# EasyEDA Pro project CAN2RPM.epro

# Schematic untitled
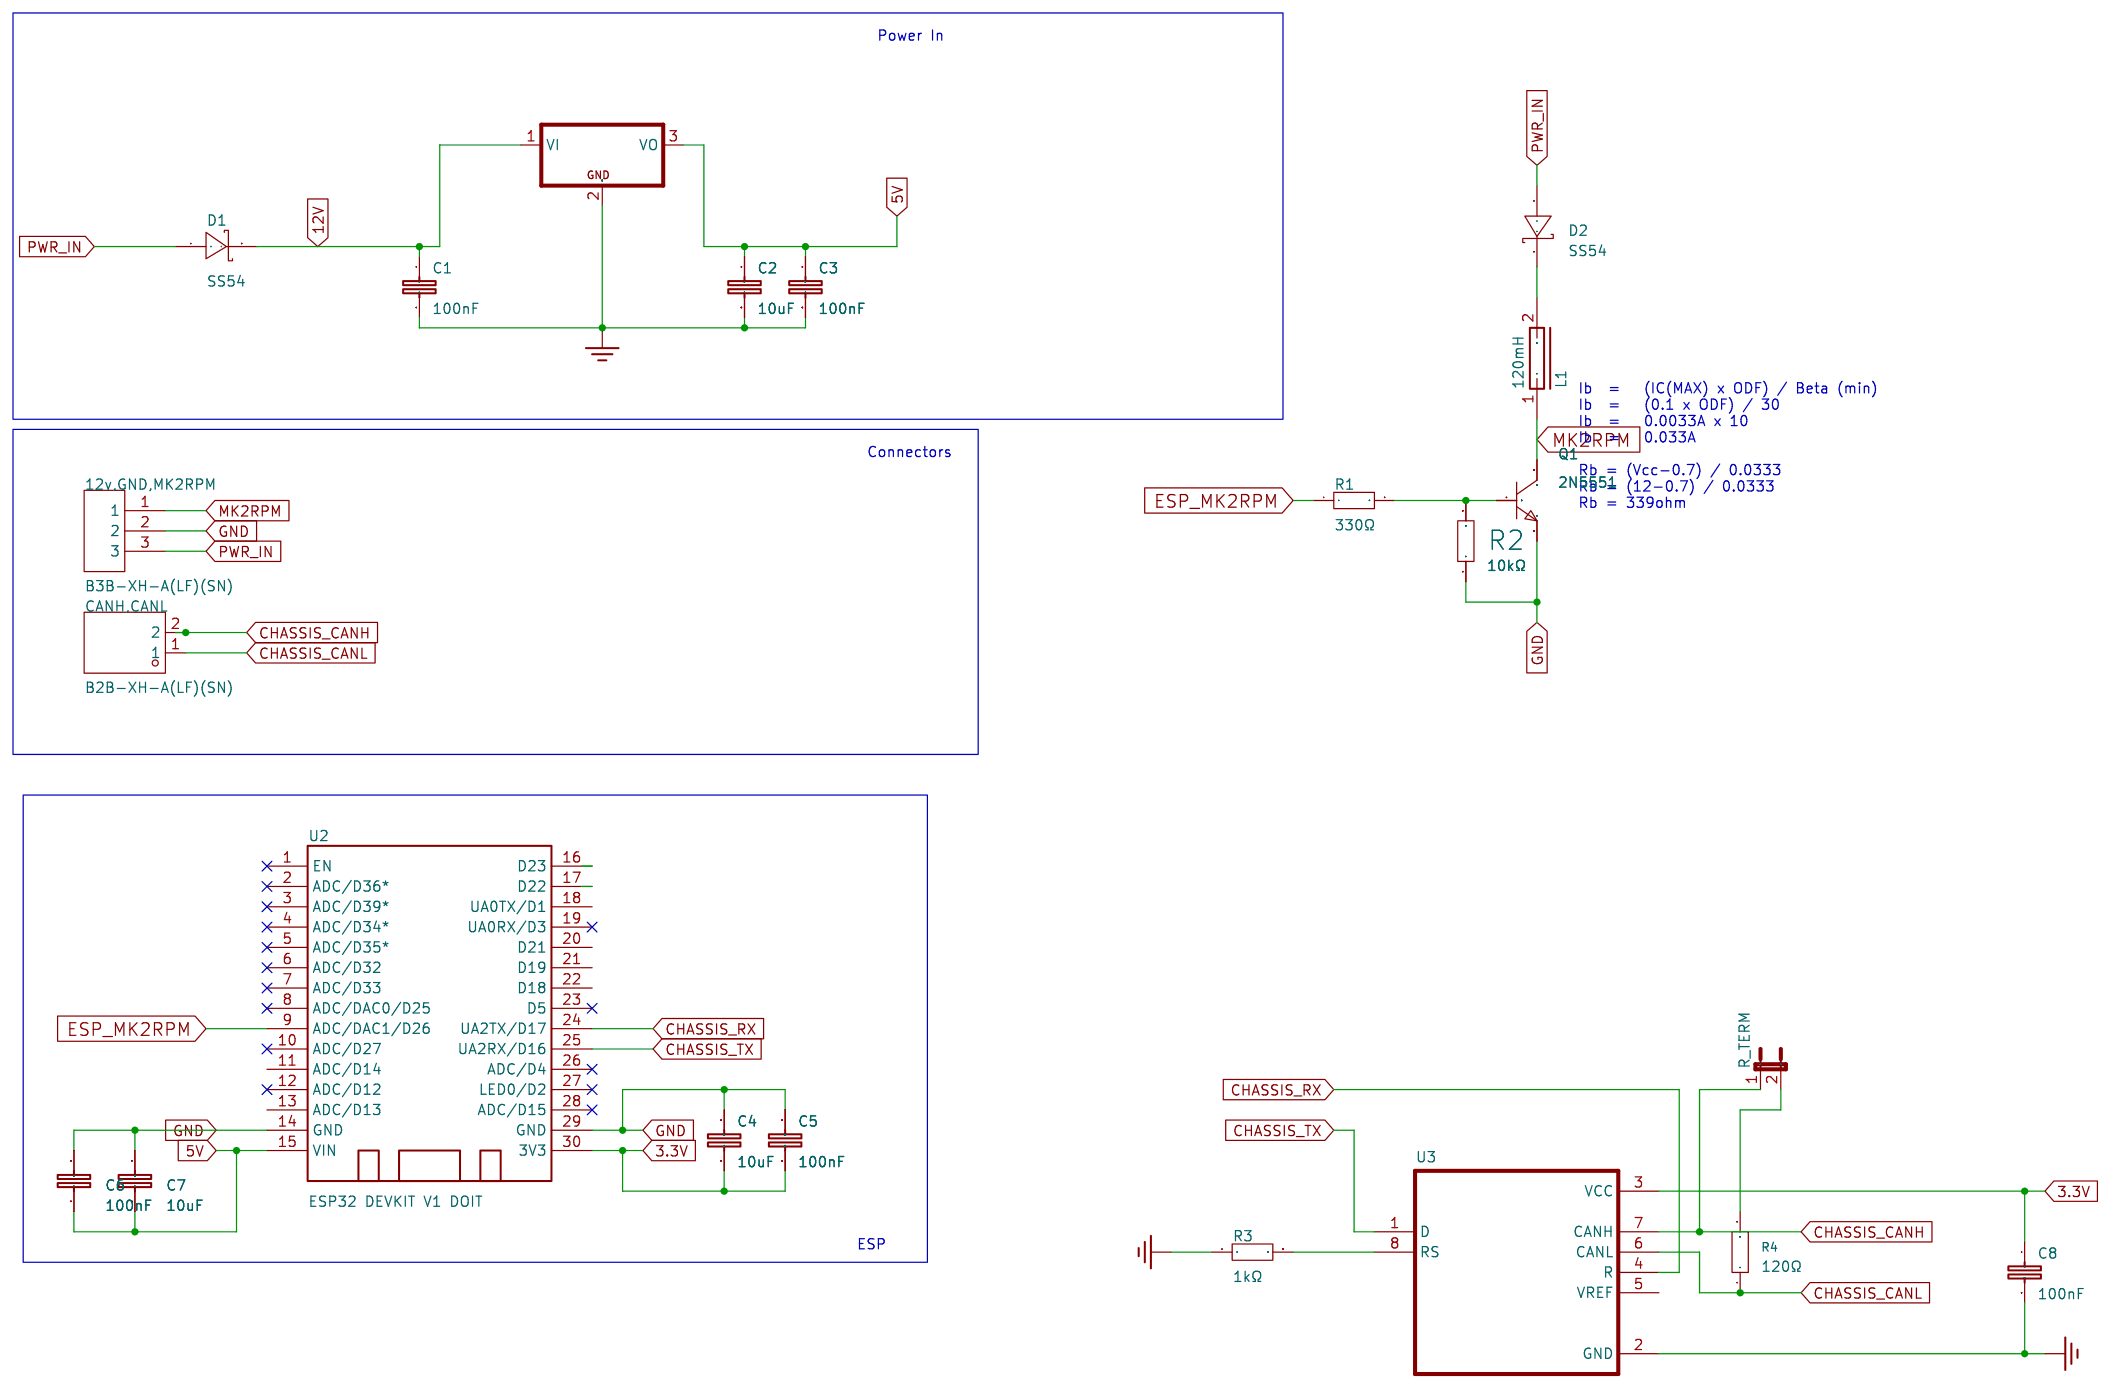
[diagram p0: schematic sheet]

## Parts
12v,GND,MK2RPM  B3B-XH-A(LF)(SN)  [CONN-TH_3P-P2.50_A2501WV2-3P]
C1  100nF  [C0805]
C2  10uF  [C0805]
C3  100nF  [C0805]
C4  10uF  [C0805]
C5  100nF  [C0603]
C6  100nF  [C0603]
C7  10uF  [C0805]
C8  100nF  [C0805]
CANH,CANL  B2B-XH-A(LF)(SN)  [CONN-TH_B2B-XH-A-LF-SN]
D1  SS54  [SMA_L4.4-W2.8-LS5.4-R-RD]
D2  SS54  [SMA_L4.4-W2.8-LS5.4-R-RD]
IC1  L7805ABD2T-TR  [TO-263-2_L10.0-W9.2-P5.08-LS15.3-TL-CW]
L1  120mH  [IND-SMD_L12.5-W12.5]
Q1  2N5551  [SOT-23-3_L2.9-W1.4-P1.90-LS2.5-BR]
R1  330Ω  [R0603]
R2  10kΩ  [R0603]
R3  1kΩ  [R0603]
R4  120Ω  [R0603]
R_TERM  PZ254V-11-02P  [HDR-TH_2P-P2.54-V-M]
U2  ESP32 DEVKIT V1 DOIT  [DOIT-ESP32-DEVKIT-V1]
U3  SN65HVD230DR  [SOIC-8_L4.9-W3.9-P1.27-LS6.0-BL]

## Library data of the parts
12v,GND,MK2RPM = B3B-XH-A(LF)(SN): Pins Structure:1x3P Pitch:2.5mm Mounting Style:Direct Insert Reference Series:XH Number of Pins:3P Number of Rows:1 Number of PINs Per Row:3 Row Spacing:- Current Rating (Max):3A Contact Material:Brass Contact Plating:Tin Operating Temperature Range:-25℃~; LCSC Part Name: 1x3P 间距:2.5mm 直插 系列:XH; Supplier Part: C144394; Manufacturer: JST; Supplier Footprint: 插件,P=2.5mm; JLCPCB Part Class: Extended Part; Datasheet: https://atta.szlcsc.com/upload/public/pdf/source/20180928/C265283_F9DFEEBDB2CF642B6BDFAB4B77BD2680.pdf; Supplier: LCSC; Pins Structure: 1x3P; Pitch: 2.5mm; Mounting Style: Direct Insert; Reference Series: XH; Number of Pins: 3P; Number of Rows: 1; Number of PINs Per Row: 3; Current Rating (Max): 3A; Contact Material: Brass; Contact Plating: Tin; Operating Temperature Range: -25℃~+85℃; Rated Voltage (Max): 250V; Plastic Material: PA66; Flame Retardant Rating: UL94V-0; Supplementary Features: K-leg punch; Colour: White; Z-Height of the Board: 7mm; X-Length of Bottom Edge on Board (Spacing Line): 9.9mm; Y-Width of Bottom Edge on Board: 5.75mm
C1 C3 C8 = CT41G-0805-2X1-50V-0.1μF-K(N): Capacitance:100nF Tolerance:±10% Tolerance:±10% Voltage Rating:50V Temperature Coefficient:-; LCSC Part Name: 100nF ±10% 50V; Supplier Part: C126469; Manufacturer: TORCH(火炬); Supplier Footprint: 0805; JLCPCB Part Class: Extended Part; Datasheet: https://atta.szlcsc.com/upload/public/pdf/source/20171225/C150708_15141883600121203188.pdf; Supplier: LCSC; Tolerance: ±10%; Voltage Rating: 50V
C2 C4 C7 = CL21A106KAYNNNE_C15850: Capacitance: Tolerance:±10% Tolerance:±10% Voltage Rated: Temperature Coefficient:; LCSC Part Name: 10uF ±10% 25V; Supplier Part: C15850; Manufacturer: SAMSUNG(三星); Manufacturer Part: CL21A106KAYNNNE; Supplier Footprint: 0805; JLCPCB Part Class: Basic Part; Datasheet: https://atta.szlcsc.com/upload/public/pdf/source/20160218/1457707763339.pdf; Supplier: LCSC; Tolerance: ±10%
C5 C6 = CC0603KRX7R9BB104: Capacitance:100nF Tolerance:±10% Tolerance:±10% Voltage Rating:50V Temperature Coefficient:X7R; LCSC Part Name: 100nF ±10% 50V; Supplier Part: C14663; Manufacturer: YAGEO(国巨); Supplier Footprint: 0603; JLCPCB Part Class: Basic Part; Datasheet: https://atta.szlcsc.com/upload/public/pdf/source/20250214/096C4C206003071F5D32E5F0D8E7F8DF.pdf; Supplier: LCSC; Tolerance: ±10%; Voltage Rating: 50V; Temperature Coefficient: X7R
CANH,CANL = B2B-XH-A(LF)(SN): Pins Structure:1x2P Pitch:2.5mm Mounting Style:Direct Insert Reference Series:XH Number of Pins:2P Number of Rows:1 Number of PINs Per Row:2 Row Spacing:- Current Rating (Max):3A Contact Material:Brass Contact Plating:Tin Operating Temperature Range:-25℃~; LCSC Part Name: 1x2P 间距:2.5mm 直插 系列:XH; Supplier Part: C158012; Manufacturer: JST; Supplier Footprint: 插件,P=2.5mm; JLCPCB Part Class: Extended Part; Datasheet: https://atta.szlcsc.com/upload/public/pdf/source/20180928/C265283_F9DFEEBDB2CF642B6BDFAB4B77BD2680.pdf; Supplier: LCSC; Pins Structure: 1x2P; Pitch: 2.5mm; Mounting Style: Direct Insert; Reference Series: XH; Number of Pins: 2P; Number of Rows: 1; Number of PINs Per Row: 2; Current Rating (Max): 3A; Contact Material: Brass; Contact Plating: Tin; Operating Temperature Range: -25℃~+85℃; Rated Voltage (Max): 250V; Plastic Material: PA66; Flame Retardant Rating: UL94V-0; Supplementary Features: K-leg punch; Colour: White; Z-Height of the Board: 7mm; X-Length of Bottom Edge on Board (Spacing Line): 7.4mm; Y-Width of Bottom Edge on Board: 5.75mm
D1 D2 = SS54_C22452: Diode Configuration:Independent Type Forward Voltage (Vf@If):550mV@5A Reverse Voltage (Vr):40V Rectified Current:5A Reverse Leakage Current (Ir):1mA@40V; LCSC Part Name: 电压:40V 电流:5A; Supplier Part: C22452; Manufacturer: MDD(辰达半导体); Supplier Footprint: SMA(DO-214AC); JLCPCB Part Class: Basic Part; Datasheet: https://atta.szlcsc.com/upload/public/pdf/source/20240710/73DFBB65C1883B895E62D589679033DF.pdf; Supplier: LCSC; Diode Configuration: Independent Type; Forward Voltage (Vf@If): 550mV@5A; Reverse Voltage (Vr): 40V; Rectified Current: 5A; Reverse Leakage Current (Ir): 1mA@40V
IC1 = L7805ABD2T-TR: Output Type:Fixed Maximum Input Voltage:35V Output Voltage:5V Output Voltage:5V Output Current:1.5A Power Supply Rejection Ratio (PSRR):68dB@(120Hz) Dropout Voltage:2V@(1A) standby current:6mA Feature:Short-Circuit  Protection；Thermal Protection(TSD) Oper; LCSC Part Name: 正稳压器IC; Supplier Part: C86206; Manufacturer: ST(意法半导体); Supplier Footprint: TO-263-2; JLCPCB Part Class: Extended Part; Datasheet: https://atta.szlcsc.com/upload/public/pdf/source/20191219/C472632_C0855675BBC73B8C8E44EE1325AAD56A.pdf; Supplier: LCSC; Output Type: Fixed; Maximum Input Voltage: 35V; Output Voltage: 5V; Output Current: 1.5A; Power Supply Rejection Ratio (PSRR): 68dB@(120Hz); Dropout Voltage: 2V@(1A); standby current: 6mA; Feature: Short-Circuit  Protection；Thermal Protection(TSD); Operating Temperature: -40℃~+125℃; Output Polarity: Positive electrode; Number of Outputs: 1
L1 = DR125-124-R: Inductance:120mH Tolerance:±20% Tolerance:±20% Current Rating:60mA Current - Saturation(Isat):69mA DC Resistance(DCR):150Ω Type:- Ratings:-; LCSC Part Name: 120mH ±20% 69mA; Supplier Part: C2453120; Manufacturer: EATON(伊顿); Supplier Footprint: SMD,12.5x12.5mm; JLCPCB Part Class: Extended Part; Datasheet: https://atta.szlcsc.com/upload/public/pdf/source/20210417/1890D5F29C45E96B4D8E6D27BBAB5A55.pdf; Supplier: LCSC; Tolerance: ±20%; Current Rating: 60mA; Current - Saturation(Isat): 69mA; DC Resistance(DCR): 150Ω
Q1 = 2N5551_C7529570: Transistor Type: Collector Current (Ic): Collector-Emitter Breakdown Voltage (Vceo): Power Dissipation (Pd):625mW DC Current Gain (hFE@Ic,Vce):80@10mA,5V DC Current Gain (hFE@Ic,Vce):80@10mA,5V Transition Frequency (fT):80MHz Collector Cut-Off Current (Ic; LCSC Part Name: NPN 电流:1A 耐压:160V; Supplier Part: C7529570; Manufacturer: RUILON(瑞隆源); Supplier Footprint: SOT-23; JLCPCB Part Class: Extended Part; Datasheet: https://atta.szlcsc.com/upload/public/pdf/source/20231206/D621ADD1802AEB70BE68282CC20D67DB.pdf; Supplier: LCSC; Power Dissipation (Pd): 625mW; DC Current Gain (hFE@Ic,Vce): 80@10mA,5V; Transition Frequency (fT): 80MHz; Collector Cut-Off Current (Icbo): 100nA; Collector-Emitter Saturation Voltage (VCE(sat)@Ic,Ib): 500mV@50mA,5mA; Operating Temperature: -55℃~+150℃
R1 = 0603WAF3300T5E: Type:Thick Film Resistors Resistance: Tolerance:±1% Tolerance:±1% Power(Watts): Overload Voltage (Max): Temperature Coefficient:±100ppm/℃ Temperature Coefficient:±100ppm/℃ Operating Temperature Range:-55℃~+155℃ Operating Temperature Range:-55℃~+155℃; LCSC Part Name: 330Ω ±1% 100mW 厚膜电阻; Supplier Part: C23138; Manufacturer: UNI-ROYAL(厚声); Supplier Footprint: 0603; JLCPCB Part Class: Basic Part; Datasheet: https://atta.szlcsc.com/upload/public/pdf/source/20200306/C422600_1E6D84923E4A46A82E41ADD87F860B5C.pdf; Supplier: LCSC; Type: Thick Film Resistors; Tolerance: ±1%; Temperature Coefficient: ±100ppm/℃; Operating Temperature Range: -55℃~+155℃
R2 = 0603WAF1002T5E: Type:Thick Film Resistor Resistance:10kΩ Tolerance:±1% Tolerance:±1% Power(Watts):100mW Voltage-Supply(Max):75V Temperature Coefficient:±100ppm/℃ Temperature Coefficient:±100ppm/℃ Operating Temperature:-55℃~+155℃ Operating Temperature:-55℃~+155℃; LCSC Part Name: 厚膜电阻 10kΩ ±1% 100mW; Supplier Part: C25804; Manufacturer: UNI-ROYAL(厚声); Supplier Footprint: 0603; JLCPCB Part Class: Basic Part; Datasheet: https://atta.szlcsc.com/upload/public/pdf/source/20200306/C422600_1E6D84923E4A46A82E41ADD87F860B5C.pdf; Supplier: LCSC; Type: Thick Film Resistor; Tolerance: ±1%; Power(Watts): 100mW; Voltage-Supply(Max): 75V; Temperature Coefficient: ±100ppm/℃; Operating Temperature: -55℃~+155℃
R3 = 0603WAF1001T5E: Type:Thick Film Resistors Resistance:1kΩ Tolerance:±1% Tolerance:±1% Power(Watts): Overload Voltage (Max): Temperature Coefficient:±100ppm/℃ Temperature Coefficient:±100ppm/℃ Operating Temperature Range:-55℃~+155℃ Operating Temperature Range:-55℃~+155℃; LCSC Part Name: 1kΩ ±1% 100mW 厚膜电阻; Supplier Part: C21190; Manufacturer: UNI-ROYAL(厚声); Supplier Footprint: 0603; JLCPCB Part Class: Basic Part; Datasheet: https://atta.szlcsc.com/upload/public/pdf/source/20200306/C422600_1E6D84923E4A46A82E41ADD87F860B5C.pdf; Supplier: LCSC; Type: Thick Film Resistors; Tolerance: ±1%; Temperature Coefficient: ±100ppm/℃; Operating Temperature Range: -55℃~+155℃
R4 = 0603WAF1200T5E: Type:Thick Film Resistors Resistance: Tolerance:±1% Tolerance:±1% Power(Watts): Overload Voltage (Max): Temperature Coefficient:±100ppm/℃ Temperature Coefficient:±100ppm/℃ Operating Temperature Range:-55℃~+155℃ Operating Temperature Range:-55℃~+155℃; LCSC Part Name: 120Ω ±1% 100mW 厚膜电阻; Supplier Part: C22787; Manufacturer: UNI-ROYAL(厚声); Supplier Footprint: 0603; JLCPCB Part Class: Basic Part; Datasheet: https://atta.szlcsc.com/upload/public/pdf/source/20200306/C422600_1E6D84923E4A46A82E41ADD87F860B5C.pdf; Supplier: LCSC; Type: Thick Film Resistors; Tolerance: ±1%; Temperature Coefficient: ±100ppm/℃; Operating Temperature Range: -55℃~+155℃
R_TERM = PZ254V-11-02P: Pin Structure:1x2P Pitch:2.54mm Row Spacing:- Circluar Pins/Square Pins:Policy Mounting Type:Straight Number of Rows:Single Row Number of Pins:2P Current Rating:- Voltage Rating (Max):- Length of Mating Pin:6mm Insulation Height:2.5mm Length of End Connec; LCSC Part Name: 1x2P 间距:2.54mm 方针 直插; Supplier Part: C492401; Manufacturer: XFCN(兴飞); Supplier Footprint: 插件,P=2.54mm; JLCPCB Part Class: Extended Part; Datasheet: https://atta.szlcsc.com/upload/public/pdf/source/20200309/C492401_A812433581A9B211A7FFA413ADDFF0E5.pdf; Supplier: LCSC; Pin Structure: 1x2P; Pitch: 2.54mm; Circluar Pins/Square Pins: Policy; Mounting Type: Straight; Number of Rows: Single Row; Number of Pins: 2P; Length of Mating Pin: 6mm; Insulation Height: 2.5mm; Length of End Connection Pin: 3mm; Contact Material: Brass; Operating Temperature: -40℃~+105℃; Color: Black
U2 = ESP32 DEVKIT V1 DOIT
U3 = SN65HVD230DR: Type:CANtransceiver Data Rate:1Mbps Voltage - Supply:- Voltage - Supply:- Current - Supply:- Operating Temperature:-40℃~+85℃ Operating Temperature:-40℃~+85℃; LCSC Part Name: 3.3-V CAN 收发器; Supplier Part: C12084; Manufacturer: TI(德州仪器); Supplier Footprint: SOIC-8; JLCPCB Part Class: Extended Part; Datasheet: https://www.ti.com/cn/lit/gpn/sn65hvd230; Supplier: LCSC; Type: CANtransceiver; Data Rate: 1Mbps; Operating Temperature: -40℃~+85℃

## Nets
3.3V: C4.2 C5.2 C8.1 U2.30(3V3) U3.3(VCC)
5V: C2.1 C3.1 C6.1 C7.1 IC1.3(VO) U2.15(VIN)
12V: C1.1 D1.2(K) IC1.1(VI)
GND: 12v,GND,MK2RPM.2 C1.2 C2.2 C3.2 C4.1 C5.1 C6.2 C7.2 C8.2 IC1.2(GND) Q1.2(E) R2.1 R3.1 U2.14(GND) U2.29(GND) U3.2(GND)
CHASSIS_CANH: CANH,CANL.2 R_TERM.1 U3.7(CANH)
CHASSIS_CANL: CANH,CANL.1 R4.1 U3.6(CANL)
CHASSIS_RX: U2.24(UA2TX/D17) U3.4(R)
CHASSIS_TX: U2.25(UA2RX/D16) U3.1(D)
ESP_MK2RPM: R1.1 U2.9(ADC/DAC1/D26)
MK2RPM: 12v,GND,MK2RPM.1 L1.1 Q1.3(C)
PWR_IN: 12v,GND,MK2RPM.3 D1.1(A) D2.1(A)
$1N3923: R3.2 U3.8(RS)
$1N3947: R4.2 R_TERM.2
$1N4153: Q1.1(B) R1.2 R2.2
$1N4157: D2.2(K) L1.2

Not connected (* = marked no-connect by the designer): U2 1(EN)* 2(ADC/D36*)* 3(ADC/D39*)* 4(ADC/D34*)* 5(ADC/D35*)* 6(ADC/D32)* 7(ADC/D33)* 8(ADC/DAC0/D25)* 10(ADC/D27)* 11(ADC/D14) 12(ADC/D12)* 13(ADC/D13) 16(D23) 17(D22) 18(UA0TX/D1) 19(UA0RX/D3)* 20(D21) 21(D19) 22(D18) 23(D5)* 26(ADC/D4)* 27(LED0/D2)* 28(ADC/D15)*; U3 5(VREF)

## Notes on the sheet
- Power In
- Connectors
- Ib  =   (IC(MAX) x ODF) / Beta (min)
  Ib  =   (0.1 x ODF) / 30
  Ib  =   0.0033A x 10
  Ib  =   0.033A
  Rb = (Vcc-0.7) / 0.0333
  Rb = (12-0.7) / 0.0333
  Rb = 339ohm
- ESP

# Board untitled
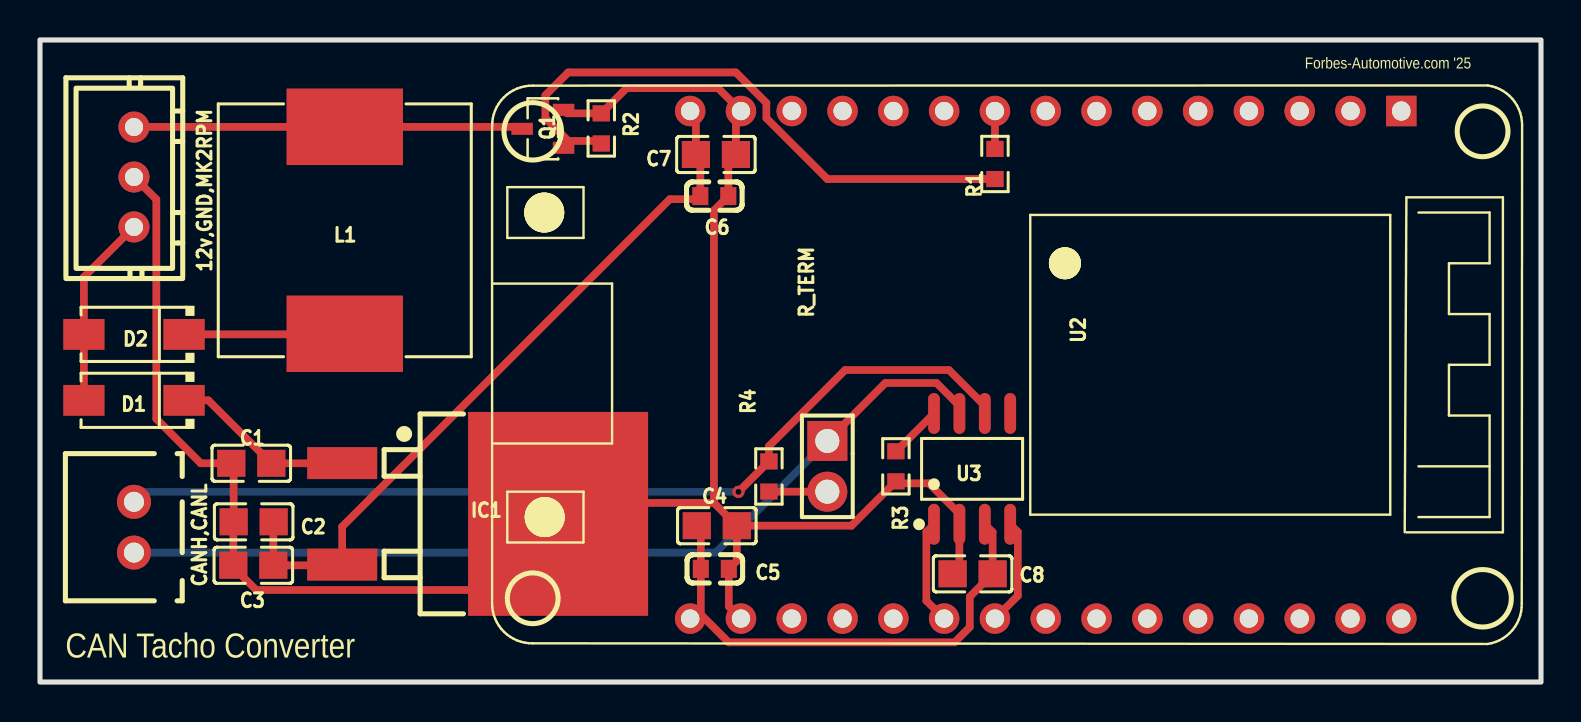
[diagram p1: board, top side]
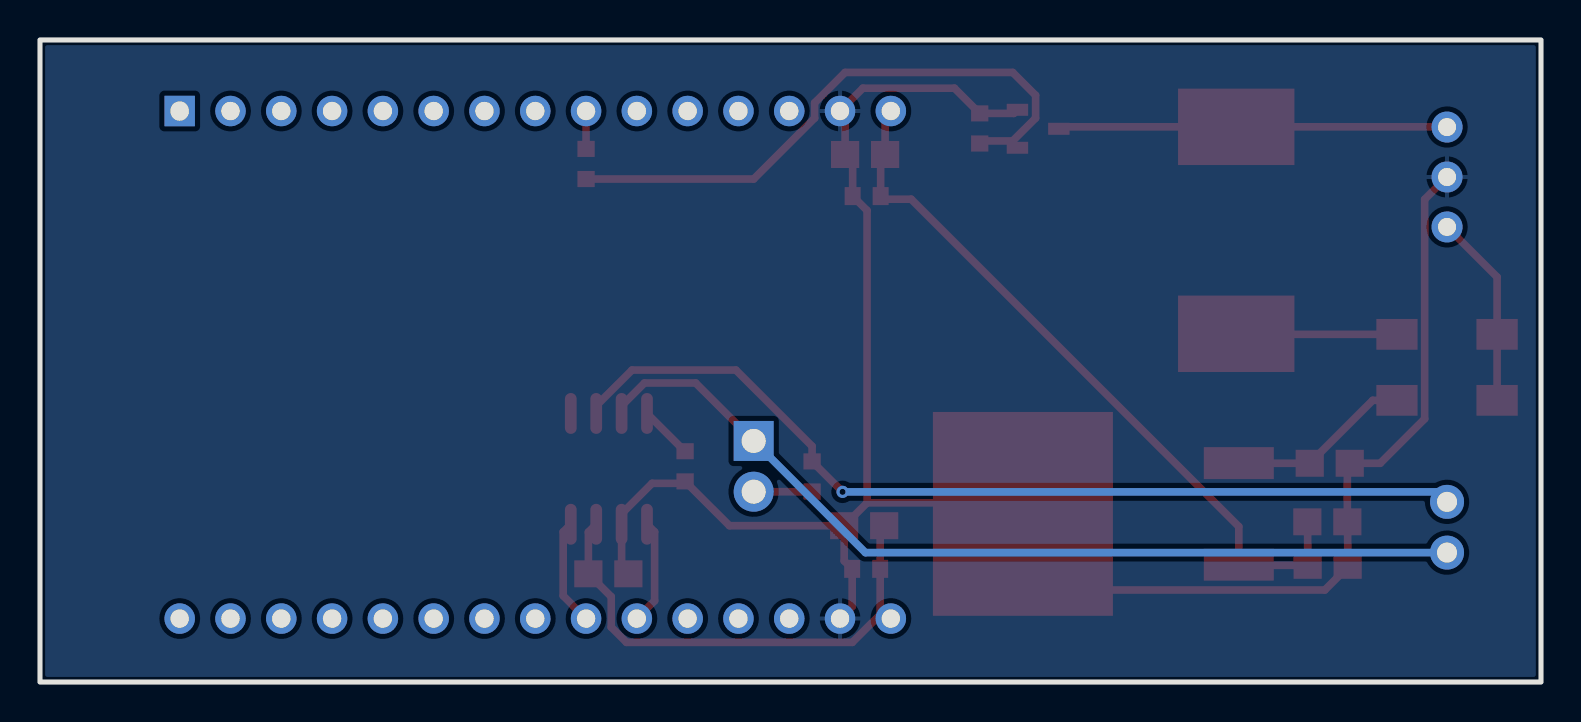
[diagram p2: board, bottom side, seen from below]

Outline 75.06 x 32.13 mm; copper layers: Top Layer, Bottom Layer. Coordinates in mm from the lower left corner of the outline.
Outline path: rectangle 0,32.13 75.06,0
Stack: Top Layer 0.035mm / Dielectric1 1.51mm FR4 er 4.5 / Bottom Layer 0.035mm

## Design rules (mm)
net CHASSIS_CANH: DP1
net CHASSIS_CANL: DP1
net CHASSIS_RX: DP2
net CHASSIS_TX: DP2
template: User Custom Config
spacing safeClearance (default): track to track 0.102, other pairs 0.152 to 0.3
track width trackWidth: min 0.457, default 0.457, max 2.54
track width default (default): min 0.305, default 0.381, max 2.54
differential pair differentialPair (default): width min 0.127, default 0.254, max 2.54; gap min 0.152, default 0.152
via viaSize: diameter min 0.35, default 0.35, max 2.6; hole min 0.35, default 0.35, max 2
via default (default): diameter min 0.5, default 0.61, max 10; hole min 0.3, default 0.305, max 6.3

## Placement (name value [footprint] x y rotation side)
12v,GND,MK2RPM  B3B-XH-A(LF)(SN)  [CONN-TH_3P-P2.50_A2501WV2-3P]  4.7 25.27 270 top
C1  100nF  [C0805]  10.56 10.95 180 top
C2  10uF  [C0805]  10.68 8.02 180 top
C3  100nF  [C0805]  10.67 5.84 180 top
C4  10uF  [C0805]  33.84 7.82 180 top
C5  100nF  [C0603]  33.74 5.66 180 top
C6  100nF  [C0603]  33.72 24.32 0 top
C7  10uF  [C0805]  33.8 26.4 0 top
C8  100nF  [C0805]  46.64 5.41 180 top
CANH,CANL  B2B-XH-A(LF)(SN)  [CONN-TH_B2B-XH-A-LF-SN]  4.7 7.75 90 top
D1  SS54  [SMA_L4.4-W2.8-LS5.4-R-RD]  4.7 14.1 180 top
D2  SS54  [SMA_L4.4-W2.8-LS5.4-R-RD]  4.7 17.4 180 top
IC1  L7805ABD2T-TR  [TO-263-2_L10.0-W9.2-P5.08-LS15.3-TL-CW]  20.51 8.41 0 top
L1  120mH  [IND-SMD_L12.5-W12.5]  15.24 22.61 90 top
Q1  2N5551  [SOT-23-3_L2.9-W1.4-P1.90-LS2.5-BR]  25.15 27.69 0 top
R1  330Ω  [R0603]  47.75 25.93 270 top
R2  10kΩ  [R0603]  28.07 27.7 270 top
R3  1kΩ  [R0603]  42.8 10.8 90 top
R4  120Ω  [R0603]  36.45 10.29 270 top
R_TERM  PZ254V-11-02P  [HDR-TH_2P-P2.54-V-M]  39.37 10.8 270 top
U2  ESP32 DEVKIT V1 DOIT  [DOIT-ESP32-DEVKIT-V1]  68.07 28.57 270 top
U3  SN65HVD230DR  [SOIC-8_L4.9-W3.9-P1.27-LS6.0-BL]  46.61 10.67 0 top

## Footprints (pads in the part's own frame, mm; a bottom-side part is the same pattern mirrored in y, then rotated)
C0603
  rect 0.8x0.9 smd: 1(-0.7,0) 2(0.7,0)
C0805
  rect 1.41x1.35 smd: 1(-1,0) 2(1,0)
CONN-TH_3P-P2.50_A2501WV2-3P
  round 1.55 hole 0.9: 1(-2.5,0) 2(0,0) 3(2.5,0)
CONN-TH_B2B-XH-A-LF-SN
  round 1.7 hole 1: 1(1.27,0) 2(-1.27,0)
DOIT-ESP32-DEVKIT-V1
  rect 1.524x1.524 hole 0.96x0.914: 1(0,0)
  round 1.524 hole 0.914: 2(0,-2.54) 3(0,-5.08) 4(0,-7.62) 5(0,-10.16) 6(0,-12.7) 7(0,-15.24) 8(0,-17.78) 9(0,-20.32) 10(0,-22.86) 11(0,-25.4) 12(0,-27.94) 13(0,-30.48) 14(0,-33.02) 15(0,-35.56) 16(25.4,0) 17(25.4,-2.54) 18(25.4,-5.08) 19(25.4,-7.62) 20(25.4,-10.16) 21(25.4,-12.7) 22(25.4,-15.24) 23(25.4,-17.78) 24(25.4,-20.32) 25(25.4,-22.86) 26(25.4,-25.4) 27(25.4,-27.94) 28(25.4,-30.48) 29(25.4,-33.02) 30(25.4,-35.56)
HDR-TH_2P-P2.54-V-M
  rect 2x2 hole 1.2: 1(-1.27,0)
  round 2 hole 1.2: 2(1.27,0)
IND-SMD_L12.5-W12.5
  rect 3.824x5.82 smd: 1(5.178,0) 2(-5.178,0)
R0603
  rect 0.806x0.864 smd: 1(-0.753,0) 2(0.753,0)
SMA_L4.4-W2.8-LS5.4-R-RD
  rect 2.062x1.539 smd: 1(2.503,0) 2(-2.503,0)
SOIC-8_L4.9-W3.9-P1.27-LS6.0-BL
  oval 0.588x2.045 smd: 1(-1.905,-2.772) 2(-0.635,-2.772) 3(0.635,-2.772) 4(1.905,-2.772) 5(1.905,2.772) 6(0.635,2.772) 7(-0.635,2.772) 8(-1.905,2.772)
SOT-23-3_L2.9-W1.4-P1.90-LS2.5-BR
  rect 1.07x0.6 smd: 1(1.035,-0.95) 2(1.035,0.95) 3(-1.035,0)
TO-263-2_L10.0-W9.2-P5.08-LS15.3-TL-CW
  rect 3.5x1.6 smd: 1(-5.397,2.54) 3(-5.397,-2.54)
  rect 9x10.2 smd: 2(5.397,0)

## Nets
As in the schematic.

Pads without a net: U2 1 2 3 4 5 6 7 8 10 11 12 13 18 19 20 21 22 23 26 27 28; U3 5

## Via types
v1: diameter 0.61, hole 0.305, Top Layer to Bottom Layer, 1 via

## Routing (per net, layer and track width the routed paths; a pad name or vN(x,y) marks a point on that pad's centre or on a via; arc(x,y) is an arc through that point)
3.3V: length 25.3
  Top Layer w0.381: 33.04,3.38 32.72,3.38 U2.30 ; 33.04,3.38 34.44,1.99 45.73,1.99 46.49,2.75 46.49,4.27 C8.1 47.64,7.5 U3.3 ; 33.04,3.38 C5.2 33.04,7.62 C4.2
5V: length 36.8
  Top Layer w0.381: U2.15 32.8,28.29 C7.1 33.02,26.18 C6.1 32.86,24.16 31.49,24.16 15.11,7.78 IC1.3 15.08,5.84 C3.1 11.67,8 C2.1
12V: length 9.2
  Top Layer w0.381: D1.2 8.42,14.1 C1.1 15.1,10.95 IC1.1
GND: length 101.6
  Top Layer w0.381: 9.67,5.75 9.67,8 C2.2 9.68,10.83 C1.2 8.04,10.95 5.82,13.17 5.82,24.16 12v,GND,MK2RPM.2 ; 9.67,5.75 10.81,4.6 22.1,4.6 IC1.2 26.46,8.97 33.7,8.97 ; 9.67,5.75 C3.2 ; C8.2 45.97,5.75 U3.2 45.97,8.42 44.45,9.94 42.9,9.94 R3.1 40.58,7.82 C4.1 ; C4.1 34.84,6.06 C5.1 34.44,3.78 U2.29 ; C4.1 33.7,8.97 ; Q1.2 26.36,28.46 R2.1 29.33,29.72 33.91,29.72 U2.14 34.8,28.32 C7.2 34.42,26.02 C6.2 33.7,23.6 33.7,8.97
CHASSIS_CANH: length 45.6
  Top Layer w0.381: U3.7 45.97,13.82 44.83,14.96 42.27,14.96 R_TERM.1
  Bottom Layer w0.381: R_TERM.1 33.78,6.48 CANH,CANL.2
CHASSIS_CANL: length 46.8
  Top Layer w0.381: U3.6 47.24,13.82 45.45,15.61 40.26,15.61 36.45,11.8 R4.1 v1(34.93,9.52)
  Bottom Layer w0.381: CANH,CANL.1 5.2,9.52 v1(34.93,9.52)
CHASSIS_RX: length 5.4
  Top Layer w0.381: U2.24 48.9,4.32 48.9,7.51 U3.4
CHASSIS_TX: length 5.2
  Top Layer w0.381: U2.25 44.32,4.06 44.32,7.51 U3.1
ESP_MK2RPM: length 1.9
  Top Layer w0.381: R1.1 U2.9
MK2RPM: length 19.5
  Top Layer w0.381: 12v,GND,MK2RPM.1 4.71,27.78 L1.1 24.01,27.78 Q1.3
PWR_IN: length 9.7
  Top Layer w0.381: 12v,GND,MK2RPM.3 2.2,20.27 D2.1 D1.1
$1N3923: length 2.7
  Top Layer w0.381: U3.8 42.81,11.55 R3.2
$1N3947: length 2.9
  Top Layer w0.381: R4.2 36.46,9.52 R_TERM.2
$1N4153: length 30.5
  Top Layer w0.381: Q1.1 26.42,26.97 26.42,27.08 ; 26.42,27.08 25.27,28.22 25.27,29.36 26.42,30.51 34.8,30.51 36.32,28.98 36.32,28.22 39.37,25.17 R1.2 ; 26.42,27.08 27.94,27.08 R2.2
$1N4157: length 8
  Top Layer w0.381: D2.2 15.21,17.4 L1.2

## Copper pours and planes (outline as drawn; the poured copper is in the pictures)
GND on Bottom Layer: 0,32.13 75.06,32.13 75.06,0 0,0

## Text on the board
Top Silkscreen Layer: Forbes-Automotive.com '25 | CAN Tacho Converter
